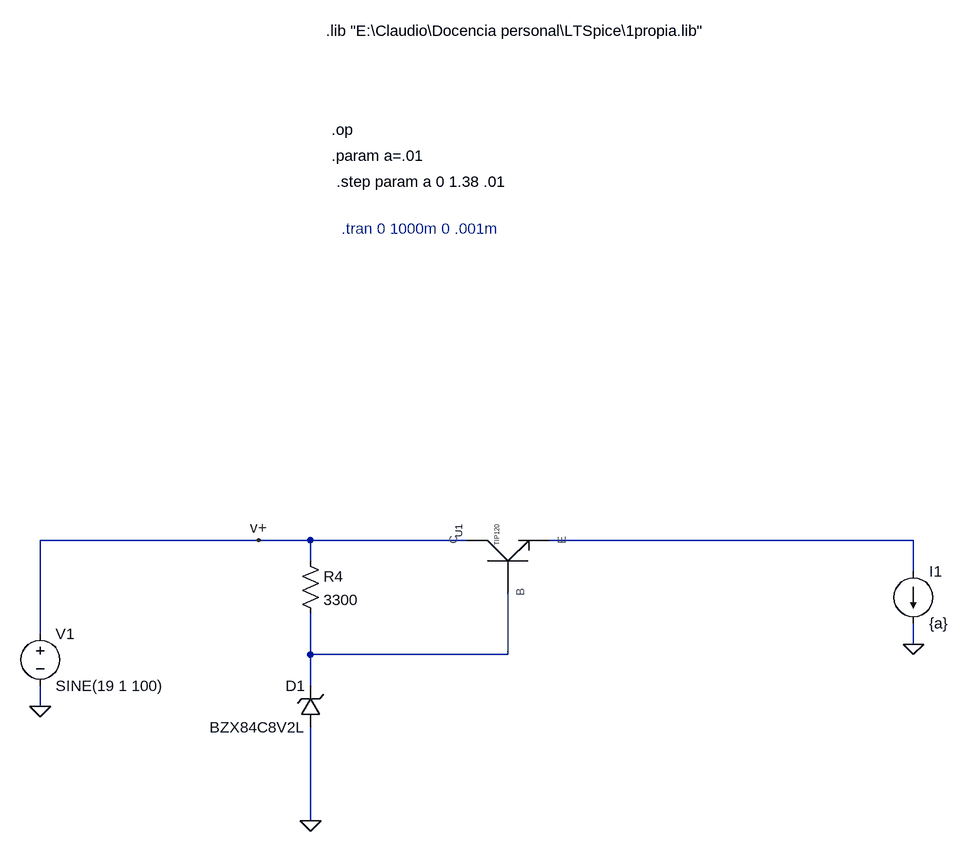
[diagram p0: schematic fuente basica zener 1sc.asc]
fuente basica zener 1sc.asc, the LTspice schematic file:
Version 4
SHEET 1 1284 680
WIRE 208 224 -128 224
WIRE 288 224 208 224
WIRE 528 224 288 224
WIRE 1216 224 656 224
WIRE 288 256 288 224
WIRE 1216 272 1216 224
WIRE -128 368 -128 224
WIRE 1216 384 1216 352
WIRE 288 400 288 336
WIRE 592 400 592 304
WIRE 592 400 288 400
WIRE 288 448 288 400
WIRE -128 480 -128 448
WIRE 288 656 288 512
FLAG 208 224 v+
FLAG 288 656 0
FLAG 1216 384 0
FLAG -128 480 0
DATAFLAG 1168 224 ""
DATAFLAG 352 224 ""
DATAFLAG 512 400 ""
SYMBOL Propia\\Darlington\ npn 592 256 R270
SYMATTR Value TIP120
SYMATTR InstName U1
SYMBOL res 272 240 R0
SYMATTR InstName R4
SYMATTR Value 3300
SYMBOL zener 304 512 R180
WINDOW 0 24 64 Left 2
WINDOW 3 24 0 Left 2
SYMATTR InstName D1
SYMATTR Value BZX84C8V2L
SYMBOL current 1216 272 R0
WINDOW 123 0 0 Left 0
WINDOW 39 0 0 Left 0
SYMATTR InstName I1
SYMATTR Value {a}
SYMBOL voltage -128 352 R0
WINDOW 123 0 0 Left 0
WINDOW 39 0 0 Left 0
SYMATTR InstName V1
SYMATTR Value SINE(19 1 100)
TEXT 312 -560 Left 2 !.lib "E:\\Claudio\\Docencia personal\\LTSpice\\1propia.lib"
TEXT 320 -408 Left 2 !.op
TEXT 320 -368 Left 2 !.param a=.01
TEXT 328 -328 Left 2 !.step param a 0 1.38 .01
TEXT 336 -256 Left 2 ;.tran 0 1000m 0 .001m

The netlist it stands for:
* fuente basica zener 1sc.asc
XU1 v+ N002 N001 TIP120  ; pins C B E
R4 v+ N002 3300
D1 0 N002 BZX84C8V2L
I1 N001 0 {a}
V1 v+ 0 SINE(19 1 100)
.model D D
.lib standard.dio
.lib "E:\Claudio\Docencia personal\LTSpice\1propia.lib"
.op
.param a=.01
.step param a 0 1.38 .01
* .tran 0 1000m 0 .001m
.backanno
.end